# Altium schematic sheet 300_Power.SchDoc
size A; SheetNumber: 5; SheetTotal: 5
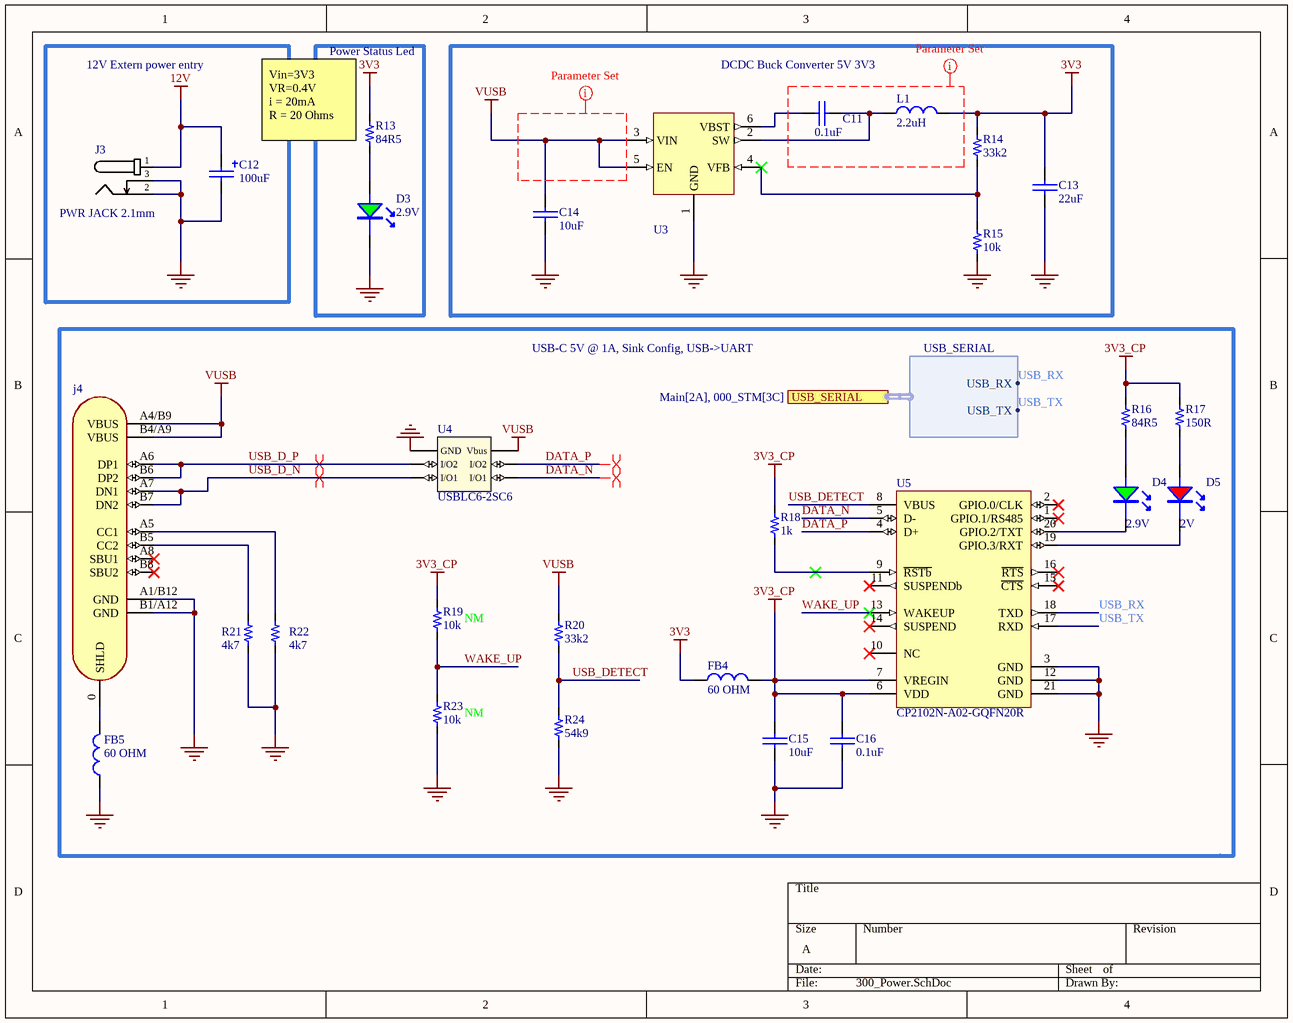
[diagram p0: 300_Power.SchDoc]

## Parts
C11  value 0.1uF  [0603_cap]  (hidden comment: 0.1uF 50V)
C12  value 100uF  [CAP_TH_2.5MM_6.3*12MM]  (hidden comment: 100uF 35V)
C13  value 22uF  [0603_cap]  (hidden comment: 22uF 10V)
C14  value 10uF  [0603_cap]  (hidden comment: 10uF 10V)
C15  value 10uF  [0603_cap]  (hidden comment: 10uF 10V)
C16  value 0.1uF  [0603_cap]  (hidden comment: 0.1uF 50V)
D3  2.9V  [0805_LED]
D4  2.9V  [0805_LED]
D5  2V  [0805_LED]
FB4  value 60 OHM  [0603_fb]  (hidden comment: 60OHM 2A)
FB5  value 60 OHM  [0603_fb]  (hidden comment: 60OHM 2A)
J3  PWR JACK 2.1mm  [CON_POWER_BARREL_2.1MM_3CONN]
j4  USB C  [CON_USB_C_16P_RA]  (value not drawn)
L1  value 2.2uH  [Ind_5.8*5.2_NS]  (hidden comment: 2.2uH 4A)
R13  value 84R5  [0603_res]  (hidden comment: 84R5 1/10W)
R14  value 33k2  [0603_res]  (hidden comment: 33k2 1/10W)
R15  value 10k  [0603_res]  (hidden comment: 10k 1/10W)
R16  value 84R5  [0603_res]  (hidden comment: 84R5 1/10W)
R17  value 150R  [0603_res]  (hidden comment: 150R 1/10W)
R18  value 1k  [0603_res]  (hidden comment: 1k 1/10W)
R19  value 10k  Usage: NM  [0603_res]  (hidden comment: 10k 1/10W)
R20  value 33k2  [0603_res]  (hidden comment: 33k2 1/10W)
R21  value 4k7  [0603_res]  (hidden comment: 4k7 1/10W)
R22  value 4k7  [0603_res]  (hidden comment: 4k7 1/10W)
R23  value 10k  Usage: NM  [0603_res]  (hidden comment: 10k 1/10W)
R24  value 54k9  [0603_res]  (hidden comment: 54k9 1/10W)
U3  TPS564201DDCR  [SOT_23_6]  (value not drawn)
U4  USBLC6-2SC6  [SOT_23_6]
U5  CP2102N-A02-GQFN20R  [WFQFN_20_EP_3X3MM]

## Blocks framed on the sheet
12V Extern power entry: C12 J3
Power Status Led: D3 R13
DCDC Buck Converter 5V 3V3: C11 C13 C14 L1 R14 R15 U3
USB-C 5V @ 1A, Sink Config, USB->UART: C15 C16 D4 D5 FB4 FB5 j4 R16-R24 U4 U5

## Ports
USB_SERIAL (harness USB_SERIAL, see Main[2A], 000_STM[3C])

## Harnesses
USB_SERIAL: USB_RX, USB_TX

## Nets
3V3: C13.1 FB4.1 L1.2 R13.1 R14.2
3V3_CP: C15.1 C16.1 FB4.2 R16.2 R17.2 R18.2 R19.2 U5.6(VDD) U5.7(VREGIN)
12V: C12.1 J3.1
GND: C12.2 C13.2 C14.2 C15.2 C16.2 D3.2 FB5.1 J3.2 J3.3 j4.A1/B12(GND) j4.B1/A12(GND) R15.1 R21.1 R22.1 R23.1 R24.1 U3.1(GND) U4.2(GND) U5.3(GND) U5.12(GND) U5.21(GND)
VUSB: C14.1 j4.A4/B9(VBUS) j4.B4/A9(VBUS) R20.2 U3.3(VIN) U3.5(EN) U4.5(Vbus)
DATA_N: U4.6(I/O1) U5.5(D-)
DATA_P: U4.4(I/O2) U5.4(D+)
USB_D_N: j4.A7(DN1) j4.B7(DN2) U4.1(I/O1)
USB_D_P: j4.A6(DP1) j4.B6(DP2) U4.3(I/O2)
USB_DETECT: R20.1 R24.2 U5.8(VBUS)
USB_RX: U5.18(TXD) ; port USB_SERIAL.USB_RX
USB_TX: U5.17(RXD) ; port USB_SERIAL.USB_TX
WAKE_UP: R19.1 R23.2 U5.13(WAKEUP)
NetC11_1: C11.1 L1.1 U3.2(SW)
NetC11_2: C11.2 U3.6(VBST)
NetD3_1: D3.1(A) R13.2
NetD4_1: D4.1(A) R16.1
NetD4_2: D4.2 U5.20(GPIO.2/TXT)
NetD5_1: D5.1(A) R17.1
NetD5_2: D5.2 U5.19(GPIO.3/RXT)
NetFB5_2: FB5.2 j4.0(SHLD)
Netj4_A5: j4.A5(CC1) R22.2
Netj4_B5: j4.B5(CC2) R21.2
NetR14_1: R14.1 R15.2 U3.4(VFB)
NetR18_1: R18.1 U5.9(~{RSTb})

Not connected (* = marked no-connect by the designer): j4 A8(SBU1)* B8(SBU2)*; U5 1(GPIO.1/RS485)* 2(GPIO.0/CLK)* 10(NC)* 11(SUSPENDb)* 14(SUSPEND)* 15(~{CTS})* 16(~{RTS})*

## Layout directives
differential pair; differential pair class USB_2.0_MCU: DATA_N, DATA_P, USB_D_N, USB_D_P
net class 5V_1A: (no net found under the mark)

## Notes on the sheet
- (near R13) Vin=3V3
  VR=0.4V
  i = 20mA
  R = 20 Ohms

## Library data of the parts
C11 C16 = Cap_0.1uF_0603_50V: 50V 100nF Y5V -20%~+80% 0603 Multilayer Ceramic Capacitors MLCC - SMD/SMT ROHS; Manufacturer: Walsin Tech Corp; Manufacturer Part Number: 0603F104Z500CT; Supplier 1: LCSC; Supplier Part Number 1: C83060; ComponentLink1Description: LCSC; ComponentLink1URL: https://www.lcsc.com/product-detail/Multilayer-Ceramic-Capacitors-MLCC-SMD-SMT_Walsin-Tech-Corp-0603F104Z500CT_C83060.html
C12 = Cap_100uF_ALU_TH_35V: 100uF 35V ±20% Plugin,D6.3xL12mm Aluminum Electrolytic Capacitors - Leaded ROHS; Manufacturer: HRK; Manufacturer Part Number: 35V100uF CD110; Supplier 1: LCSC; Supplier Part Number 1: C2960381; ComponentLink1Description: LCSC; ComponentLink1URL: https://lcsc.com/product-detail/Aluminum-Electrolytic-Capacitors-Leaded_HRK-35V100uF-CD110_C2960381.html
C13 = Cap_22uF_0603_10V: 10V 22uF X5R ±20% 0603 Multilayer Ceramic Capacitors MLCC - SMD/SMT ROHS; Manufacturer: HRE; Manufacturer Part Number: CGA0603X5R226M100JT; Supplier 1: LCSC; Supplier Part Number 1: C6119863; ComponentLink1Description: LCSC; ComponentLink1URL: https://lcsc.com/product-detail/Multilayer-Ceramic-Capacitors-MLCC-SMD-SMT_HRE-CGA0603X5R226M100JT_C6119863.html
C14 C15 = Cap_10uF_0603_10V: 10V 10uF X5R ±10% 0603 Multilayer Ceramic Capacitors MLCC - SMD/SMT ROHS; Manufacturer: CCTC; Manufacturer Part Number: TCC0603X5R106K100CT; Supplier 1: LCSC; Supplier Part Number 1: C380314; ComponentLink1Description: LCSC; ComponentLink1URL: https://www.lcsc.com/product-detail/Multilayer-Ceramic-Capacitors-MLCC-SMD-SMT_CCTC-TCC0603X5R106K100CT_C380314.html
D3 D4 = LED_0805_Green: LED GREEN CLEAR 0805 SMD; Manufacturer: XINGLIGHT; Manufacturer Part Number: XL-2012UGC; Supplier 1: LCSC; Supplier Part Number 1: C965815; ComponentLink1Description: LCSC; ComponentLink1URL: https://www.lcsc.com/product-detail/Light-Emitting-Diodes-LED_XINGLIGHT-XL-2012UGC_C965815.html
D5 = LED_0805_RED: LED RED CLEAR 0805 SMD; Manufacturer: XINGLIGHT; Manufacturer Part Number: XL-2012SURC; Supplier 1: LCSC; Supplier Part Number 1: C965812; ComponentLink1Description: LCSC; ComponentLink1URL: https://www.lcsc.com/product-detail/Light-Emitting-Diodes-LED_XINGLIGHT-XL-2012SURC_C965812.html
FB4 FB5 = FB_60_0603_2A: 2A 1 100mΩ 60Ω@100MHz ±25% 0603 Ferrite Beads ROHS; Manufacturer: TAI-TECH; Manufacturer Part Number: HCB1608KF-600T20; ComponentLink1Description: LCSC; ComponentLink1URL: https://www.lcsc.com/product-detail/Ferrite-Beads_TAI-TECH-HCB1608KF-600T20_C369516.html; Supplier 1: LCSC; Supplier Part Number 1: C369516
J3 = Con_Power_Jack_2.1mm_3pins: CONN PWR JACK 2X5.5MM SOLDER; Manufacturer: HCTL; Manufacturer Part Number: HC-DC-005-2.0T; Supplier 1: LCSC; Supplier Part Number 1: C3010533; ComponentLink1Description: LCSC; ComponentLink1URL: https://www.lcsc.com/product-detail/AC-DC-Power-Connectors_HCTL-HC-DC-005-2-0T_C3010533.html
j4 = CON_USB_TYPEC_16P: 3A USB 3.1 1 Surface Mount 16P Female -40℃~+85℃ Type-C SMD USB Connectors ROHS; Manufacturer: SHOU HAN; Manufacturer Part Number: TYPE-C-3.1-16PIN; Supplier 1: LCSC; Supplier Part Number 1: C7507405; ComponentLink1Description: LCSC; ComponentLink1URL: https://lcsc.com/product-detail/USB-Connectors_SHOU-HAN-TYPE-C-3-1-16PIN_C7507405.html
L1 = Inductor_2.2uH_4A_5.8*5.2mm: 4A 2.2uH ±20% 22.1mΩ SMD,5.8x5.2mm Inductors (SMD) ROHS; Manufacturer: SHOU HAN; Manufacturer Part Number: CY54-2.2UH; Supplier 1: LCSC; Supplier Part Number 1: C2929427; ComponentLink1Description: LCSC; ComponentLink1URL: https://lcsc.com/product-detail/Inductors-SMD_SHOU-HAN-CY54-2-2UH_C2929427.html
R13 R16 = Res_84R5_0603_1/10W: 100mW Thick Film Resistor 50V ±100ppm/℃ ±1% 84.5Ω 0603 Chip Resistor - Surface Mount ROHS; Manufacturer: LIZ Elec; Manufacturer Part Number: CR0603FA84R5G; ComponentLink1URL: https://lcsc.com/product-detail/Chip-Resistor-Surface-Mount_LIZ-Elec-CR0603FA84R5G_C101216.html; Supplier 1: LCSC; Supplier Part Number 1: C101216; ComponentLink1Description: LCSC
R14 R20 = Res_33k2_0603_1/10W: 100mW Thick Film Resistor 75V ±100ppm/℃ ±1% 33.2kΩ 0603 Chip Resistor - Surface Mount ROHS; Manufacturer: YAGEO; Manufacturer Part Number: RC0603FR-0733K2L; ComponentLink1URL: https://lcsc.com/product-detail/Chip-Resistor-Surface-Mount_YAGEO-RC0603FR-0733K2L_C185338.html; Supplier 1: LCSC; Supplier Part Number 1: C185338; ComponentLink1Description: LCSC
R15 R19 R23 = Res_10k_0603_1/10W: RES SMD 10k OHM 5% 1/10W 0603; Manufacturer: FOJAN; Manufacturer Part Number: FRC0603J103TS; ComponentLink1URL: https://www.lcsc.com/product-detail/Chip-Resistor-Surface-Mount_FOJAN-FRC0603J103TS_C2930027.html; Supplier 1: LCSC; Supplier Part Number 1: C2930027; ComponentLink1Description: LCSC
R17 = Res_150R_0603_1/10W: 100mW Thick Film Resistor 75V ±100ppm/℃ ±1% 150Ω 0603 Chip Resistor - Surface Mount ROHS; Manufacturer: RALEC; Manufacturer Part Number: RTT031500FTP; ComponentLink1URL: https://lcsc.com/product-detail/Chip-Resistor-Surface-Mount_RALEC-RTT031500FTP_C103302.html; Supplier 1: LCSC; Supplier Part Number 1: C103302; ComponentLink1Description: LCSC
R18 = Res_1k_0603_1/10W: RES SMD 1k OHM 5% 1/10W 0603; Manufacturer: FOJAN; Manufacturer Part Number: FRC0603J102 TS; ComponentLink1URL: https://www.lcsc.com/product-detail/Chip-Resistor-Surface-Mount_FOJAN-FRC0603J102-TS_C2907113.html; Supplier 1: LCSC; Supplier Part Number 1: C2907113; ComponentLink1Description: LCSC
R21 R22 = Res_4k7_0603_1/10W: 100mW Thick Film Resistor 75V ±1% 4.7kΩ 0603 Chip Resistor - Surface Mount ROHS; Manufacturer: VO; Manufacturer Part Number: SCR0603F4K7; ComponentLink1URL: https://lcsc.com/product-detail/Chip-Resistor-Surface-Mount_VO-SCR0603F4K7_C3016318.html; Supplier 1: LCSC; Supplier Part Number 1: C3016318; ComponentLink1Description: LCSC
R24 = Res_54k9_0603_1/10W: 100mW Thick Film Resistor 75V ±100ppm/℃ ±1% 54.9kΩ 0603 Chip Resistor - Surface Mount ROHS; Manufacturer: YAGEO; Manufacturer Part Number: RC0603FR-0754K9L; ComponentLink1URL: https://lcsc.com/product-detail/Chip-Resistor-Surface-Mount_YAGEO-RC0603FR-0754K9L_C185321.html; Supplier 1: LCSC; Supplier Part Number 1: C185321; ComponentLink1Description: LCSC
U3 = DCDC_SW_BUCK_4A_SOT23-6: IC REG BUCK ADJ 4A SOT23; Manufacturer: Texas Instruments; Manufacturer Part Number: TPS564201DDCR; Supplier 1: LCSC; Supplier Part Number 1: C464812; ComponentLink1Description: LCSC; ComponentLink1URL: https://lcsc.com/product-detail/DC-DC-Converters_Texas-Instruments-TPS564201DDCR_C464812.html
U4 = TVS_5.25V_2CH_SOT_23_6: TVS DIODE 5.25V 17V SOT23-6; Manufacturer: STMicroelectronics; ComponentLink1Description: LCSC; ComponentLink1URL: https://www.lcsc.com/product-detail/ESD-Protection-Devices_STMicroelectronics-USBLC6-2SC6_C7519.html; Supplier 1: LCSC; Manufacturer Part Number: USBLC6-2SC6; Supplier Part Number 1: C7519
U5 = IC_SGL_USB2UART-BRIDGE_20QFN: IC USB TO UART BRIDGE QFN20; Manufacturer: Silicon Labs; Manufacturer Part Number: CP2102N-A02-GQFN20R; Supplier 1: LCSC; Supplier Part Number 1: C969913; ComponentLink1Description: LCSC; ComponentLink1URL: https://www.lcsc.com/product-detail/USB-ICs_SILICON-LABS-CP2102N-A02-GQFN20R_C969913.html